# Altium project g1.PrjPcb
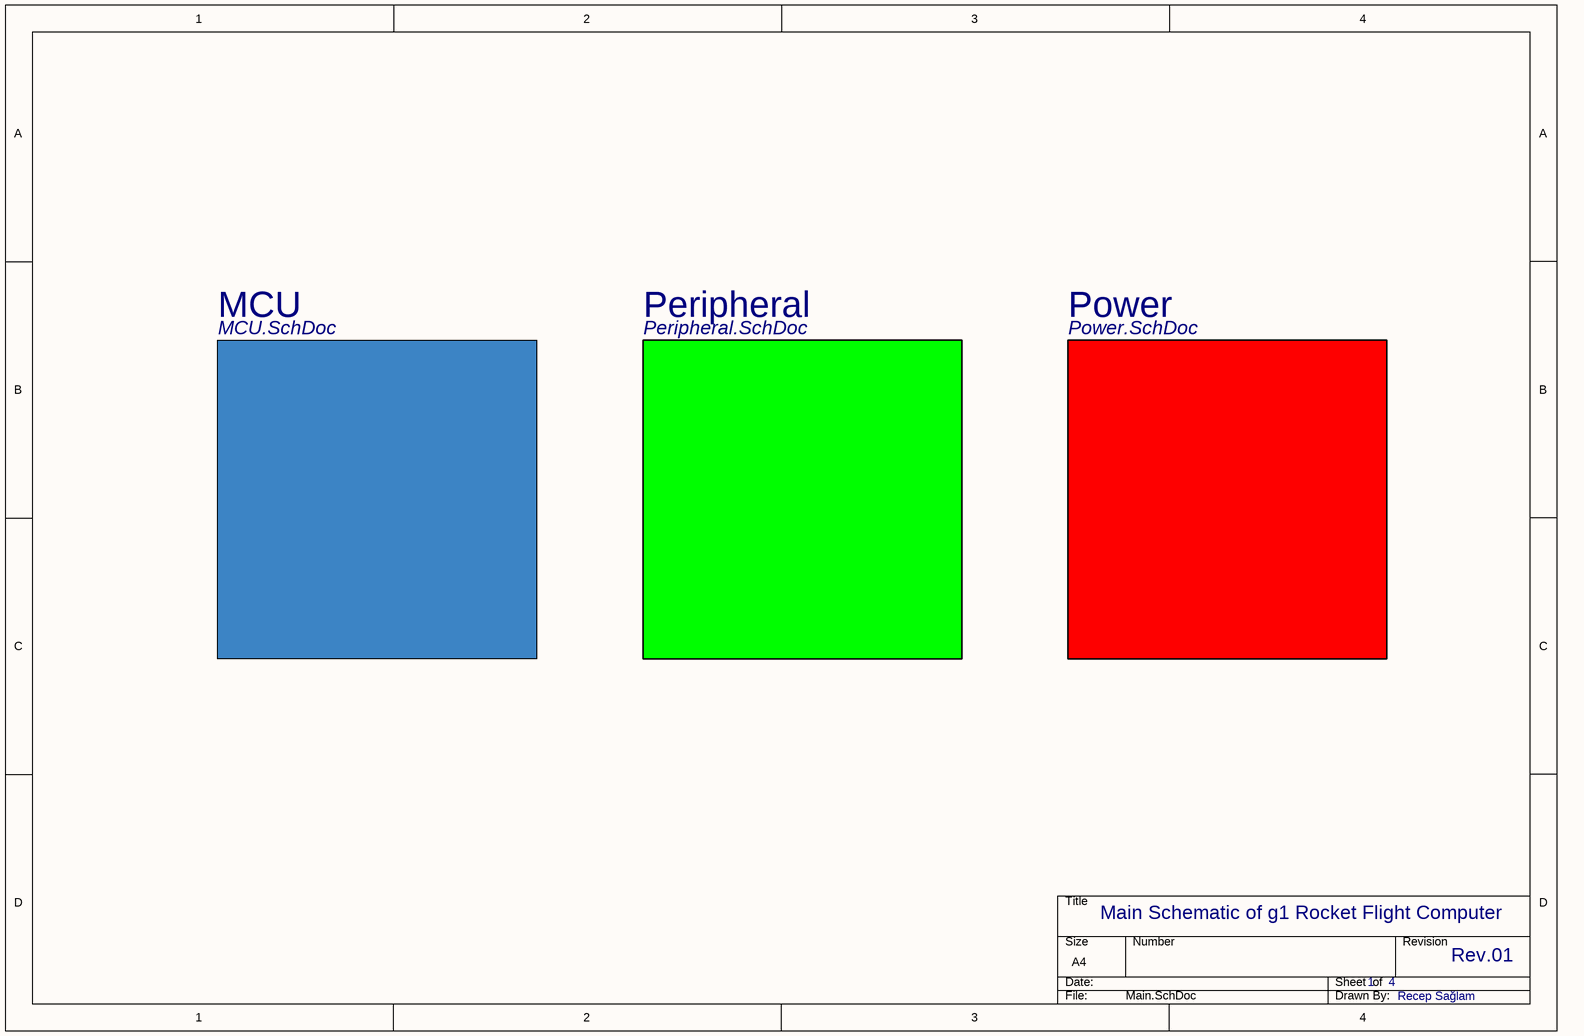
[diagram p0: Main.SchDoc]
4 sheets, 65 parts. Net scope: flat (ports and power ports of the same name join across sheets).
Board file: g1.PcbDoc
Sheets:
  Main.SchDoc
    MCU = MCU.SchDoc
    Power = Power.SchDoc
    Peripheral = Peripheral.SchDoc

## Sheet Main.SchDoc
size A4; SheetNumber: 1; SheetTotal: 4

### Sub-sheets
MCU = MCU.SchDoc: no entries
Peripheral = Peripheral.SchDoc: no entries
Power = Power.SchDoc: no entries

### Notes on the sheet
- Main Schematic of g1 Rocket Flight Computer
- 1
- 4
- Rev.01
- Recep Sağlam

## Sheet MCU.SchDoc
size 384 x 270 mm; SheetNumber: 2; SheetTotal: 4
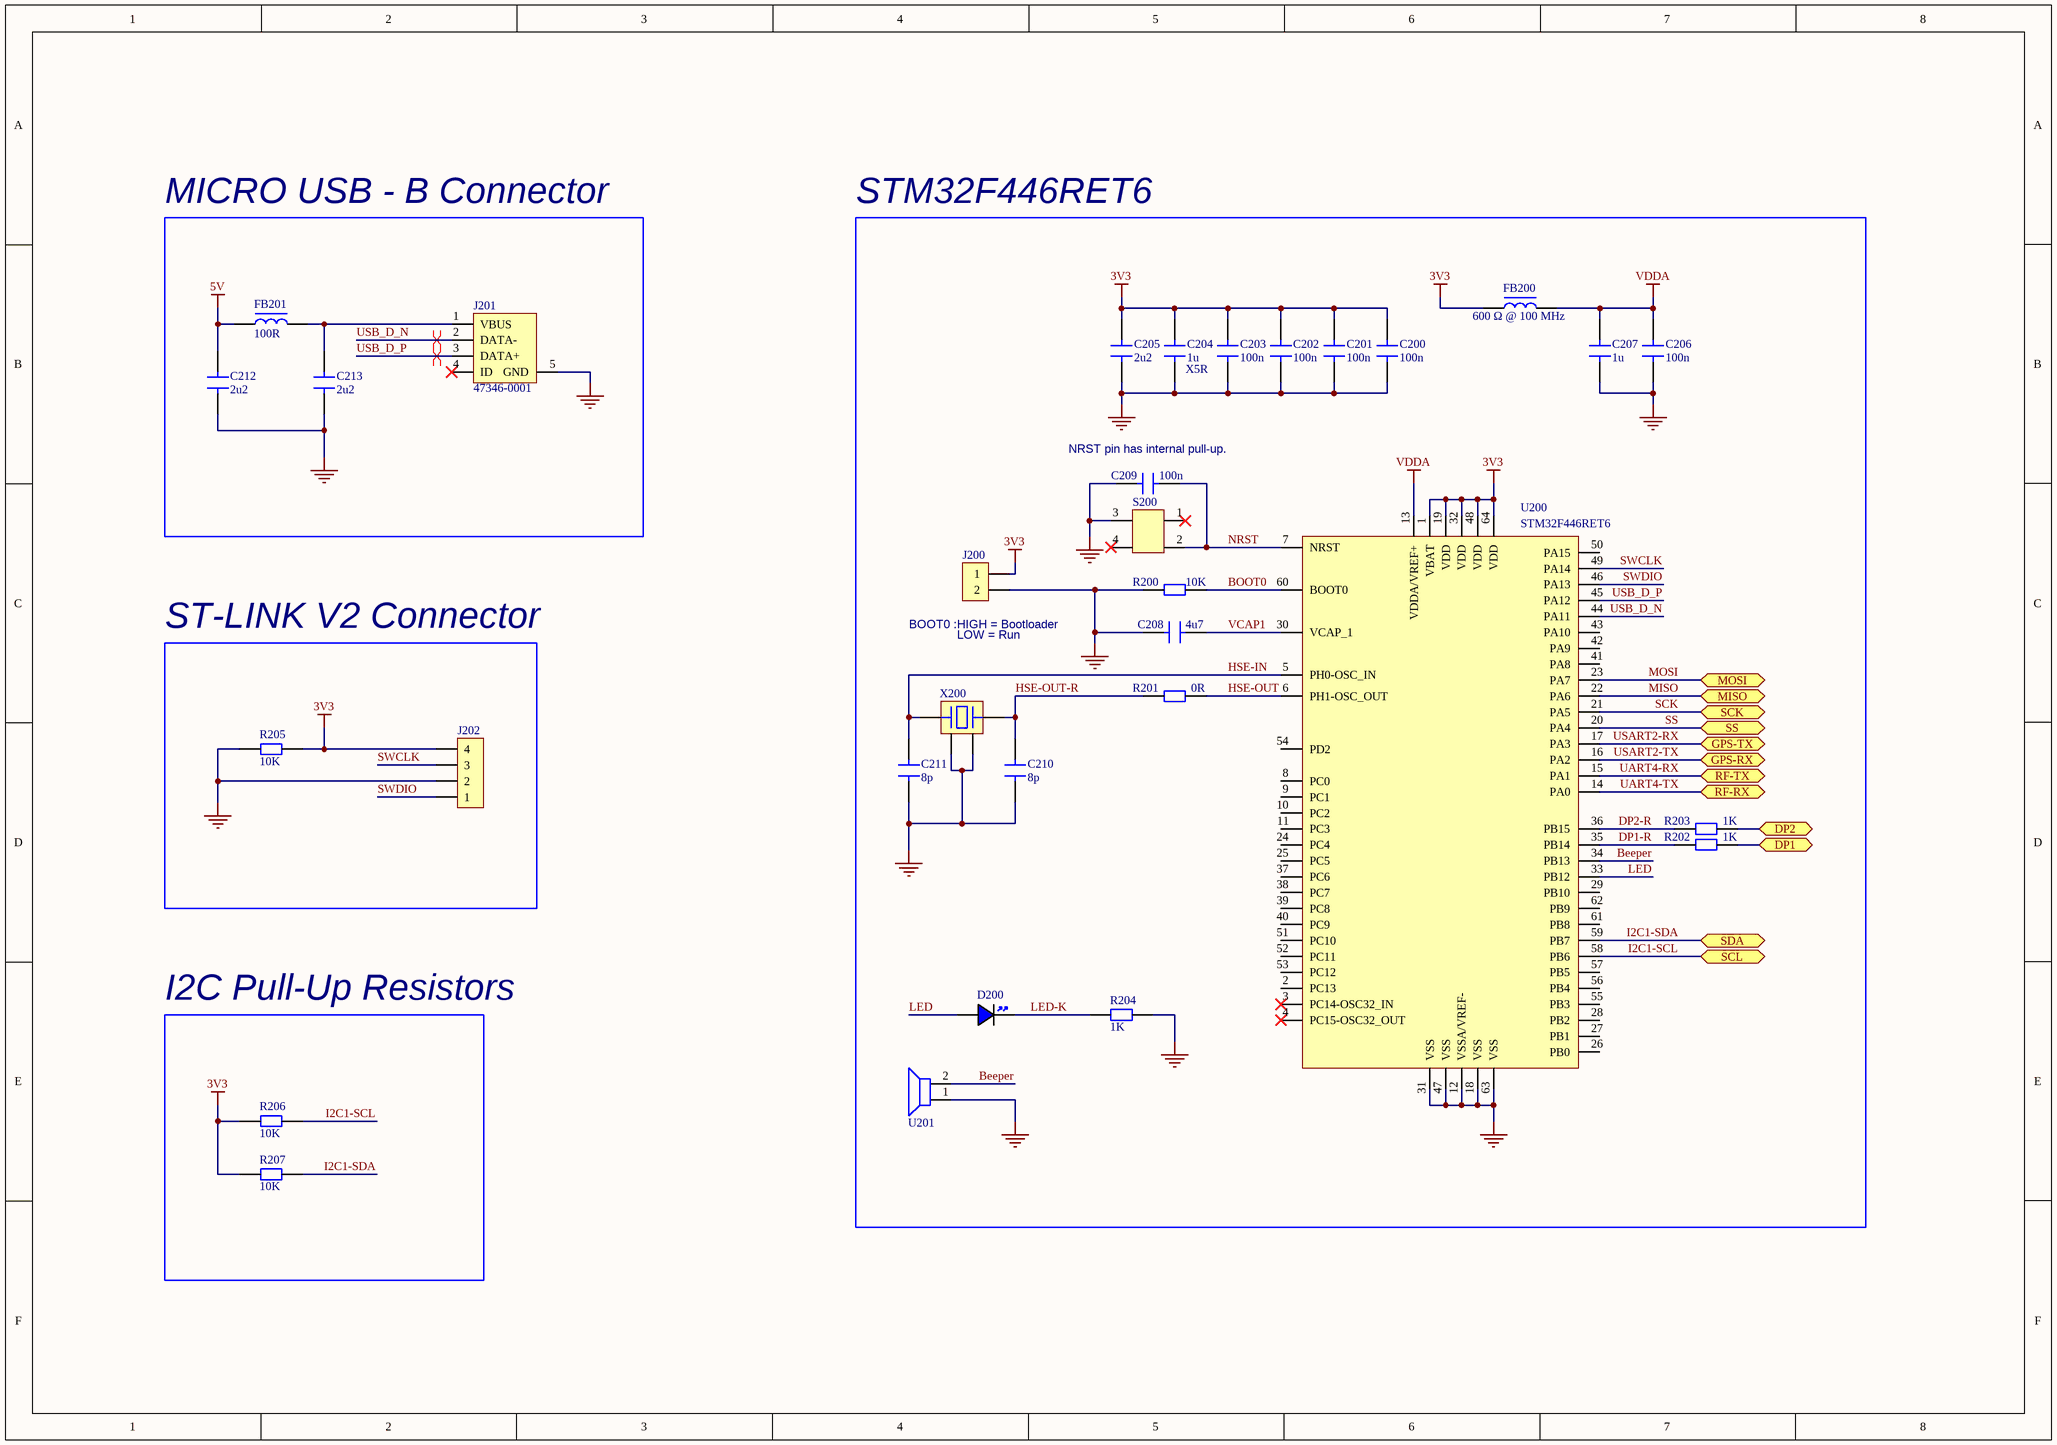
[diagram p1: MCU.SchDoc]

### Parts
C200  100n  [CAP 0603]
C201  100n  [CAP 0603]
C202  100n  [CAP 0603]
C203  100n  [CAP 0603]
C204  1u  [CAP 0603]
C205  2u2  [CAP 0603]
C206  100n  [CAP 0603]
C207  1u  [CAP 0603]
C208  4u7  [CAP 0805]
C209  100n  [CAP 0603]
C210  8p  [CAP 0603]
C211  8p  [CAP 0603]
C212  2u2  [CAP 0603]
C213  2u2  [CAP 0603]
D200  LED 0805 BLUE  [LED 0805 BLUE]  (value not drawn)
FB200  600 Ω @ 100 MHz  [FB 0603]
FB201  100R  [FB 0805]
J200  1x2 HEADER  [1x2 HEADER MALE]  (value not drawn)
J201  47346-0001  [MOLEX_47346-0001]
J202  1x4 HEADER MALE  [1X4 HEADER MALE]  (value not drawn)
R200  10K  [RES 0603]
R201  0R  [RES 0603]
R202  1K  [RES 0603]
R203  1K  [RES 0603]
R204  1K  [RES 0603]
R205  10K  [RES 0603]
R206  10K  [RES 0603]
R207  10K  [RES 0603]
S200  FSM4JSMATR  [FSM4JSMATR]  (value not drawn)
U200  STM32F446RET6  [STM32F446RET6]
U201  PS1240P02BT  [PS1240P02BT]  (value not drawn)
X200  FA-20H 16.0000MF10Z-AJ0  [FA-20H 16.0000MF10Z-AJ0]  (value not drawn)

### Blocks framed on the sheet
MICRO USB - B Connector: C212 C213 FB201 J201
STM32F446RET6: C200-C211 D200 FB200 J200 R200-R204 S200 U200 U201 X200
ST-LINK V2 Connector: J202 R205
I2C Pull-Up Resistors: R206 R207

### Ports
DP1 (bidir, see Power[1C]), DP2 (bidir, see Power[3C]), GPS-RX (bidir, see Peripheral[4C]), GPS-TX (bidir, see Peripheral[4C]), MISO (bidir, see Peripheral[1B], Peripheral[3C]), MOSI (bidir, see Peripheral[1B], Peripheral[3C]), RF-RX (bidir, see Peripheral[3C]), RF-TX (bidir, see Peripheral[3C]), SCK (bidir, see Peripheral[1B], Peripheral[3D]), SCL (bidir, see Peripheral[2C], Peripheral[3A], Peripheral[3C]), SDA (bidir, see Peripheral[2C], Peripheral[3A], Peripheral[3C]), SS (bidir, see Peripheral[1B], Peripheral[3C])

### Nets
3V3: C200.2 C201.2 C202.2 C203.2 C204.2 C205.2 FB200.1 J200.1 J202.4 R205.2 R206.2 R207.2 U200.1(VBAT) U200.19(VDD) U200.32(VDD) U200.48(VDD) U200.64(VDD)
5V: C212.1 FB201.1
GND: C200.1 C201.1 C202.1 C203.1 C204.1 C205.1 C206.1 C207.1 C208.1 C209.1 C210.1 C211.1 C212.2 C213.2 J200.2 J201.5(GND) J202.2 R200.1 R204.2 R205.1 S200.3 U200.12(VSSA/VREF-) U200.18(VSS) U200.31(VSS) U200.47(VSS) U200.63(VSS) U201.1 X200.2 X200.4
VDDA: C206.2 C207.2 FB200.2 U200.13(VDDA/VREF+)
Beeper: U200.34(PB13) U201.2
BOOT0: R200.2 U200.60(BOOT0)
DP1-R: R202.2 U200.35(PB14)
DP2-R: R203.1 U200.36(PB15)
HSE-IN: C211.2 U200.5(PH0-OSC_IN) X200.1
HSE-OUT: R201.2 U200.6(PH1-OSC_OUT)
HSE-OUT-R: C210.2 R201.1 X200.3
I2C1-SCL: R206.1 U200.58(PB6) ; port SCL
I2C1-SDA: R207.1 U200.59(PB7) ; port SDA
LED: D200.A U200.33(PB12)
LED-K: D200.K R204.1
MISO: U200.22(PA6) ; port MISO
MOSI: U200.23(PA7) ; port MOSI
NRST: C209.2 S200.2 U200.7(NRST)
SCK: U200.21(PA5) ; port SCK
SS: U200.20(PA4) ; port SS
SWCLK: J202.3 U200.49(PA14)
SWDIO: J202.1 U200.46(PA13)
UART4-RX: U200.15(PA1) ; port RF-TX
UART4-TX: U200.14(PA0) ; port RF-RX
USART2-RX: U200.17(PA3) ; port GPS-TX
USART2-TX: U200.16(PA2) ; port GPS-RX
USB_D_N: J201.2(DATA-) U200.44(PA11)
USB_D_P: J201.3(DATA+) U200.45(PA12)
VCAP1: C208.2 U200.30(VCAP_1)
NetC213_1: C213.1 FB201.2 J201.1(VBUS)
NetR202_1: R202.1 ; port DP1
NetR203_2: R203.2 ; port DP2

Not connected (* = marked no-connect by the designer): J201 4(ID)*; S200 1* 4*; U200 2(PC13) 3(PC14-OSC32_IN)* 4(PC15-OSC32_OUT)* 8(PC0) 9(PC1) 10(PC2) 11(PC3) 24(PC4) 25(PC5) 26(PB0) 27(PB1) 28(PB2) 29(PB10) 37(PC6) 38(PC7) 39(PC8) 40(PC9) 41(PA8) 42(PA9) 43(PA10) 50(PA15) 51(PC10) 52(PC11) 53(PC12) 54(PD2) 55(PB3) 56(PB4) 57(PB5) 61(PB8) 62(PB9)

### Layout directives
differential pair; differential pair class DIFF_USB: USB_D_N, USB_D_P

### Notes on the sheet
- (near C204) X5R
- (near C209) NRST pin has internal pull-up.
- (near J200) BOOT0 :
- (near J200) HIGH = Bootloader
- (near J200) LOW = Run
- DWG NO:
- REV:
- THIS DOCUMENT AND THE DATA DISCLOSED HEREIN OR
- HEREWITH IS THE PROPERTY OF ALTIUM LIMITED AND MAY
- BE FREELY DISTRIBUTED IN WHOLE. NO RIGHTS ARE
- RESERVED OR EXPRESS OR IMPLIED WARANTEE GIVEN.
- REVISION
- DESCRIPTION
- DATE
- APPROVED
- ENG:
- APPROVALS
- PROJECT
- DSN:
- CHK:
- REFERENCE DOCUMENTS
- PROJECT REVISION:
- TITLE
- DOCUMENT REVISION:
- DESIGN ITEM:
- BOM:
- FAB DWG:
- PCB DWG:
- ASSY DWG:
- SCALE:
- A2
- SIZE
- CAGE CODE
- FILE NAME
- DWG NO.
- SHEET
- OF
- REV

### Library data of the parts
C200-C203 C205-C207 C209-C213 = CAP 0603 50V: Capacitor SMD 0603 50V
C204 = CAP 0603 16V: Capacitor SMD 0603 16V
C208 = CAP 0805 25V: Capacitor SMD 0805 25V
D200 = LED 0805 BLUE: LED 0805 GREEN SMD
FB200 = FB 0603: Ferrite Bead SMD 0603
FB201 = FB 0805: Ferrite Bead SMD 0805
J201 = 47346-0001: Micro-USB B Receptacle with Flange, Bottom Mount, Surface Mount, Lead-Free; Manufacturer: Molex; Max Voltage Rating (AC): 30V; Number of Ports: 1; Contact Resistance: 40mR; Current Rating: 1.8A; Gender: Female; Connector Type: USB,Receptacle; Number of Contacts: 5; Contact Current Rating: 1A; USB Standard: USB 2.0; Pitch: 0.65mm; Glow Wire Compliant: Non-compliant; Supplier 1: Sager Electronics; Manufacturer Part Number: 47346-0001; RoHS: Yes; Category: Headers and Wire Housings; Stock 1: 14156; Pricing 1: 14000=0,5225 (USD); Mount: Surface Mount; Contact Plating: Gold; Contact Material: Copper Alloy,Copper; Housing Material: Polymer; Color: Black; Min Operating Temperature: -20°C; Max Operating Temperature: 85°C; Packaging: Tape and Reel; Termination: SMD/SMT; Orientation: Right Angle; Voltage Rating (AC): 30V; Voltage Rating: 30V; Number of Circuits: 5; Number of Positions: 5; Number of Rows: 1; Series: 47346; RoHS Compliant: Yes; Halogen Free: Low Halogen; Lead Free: Lead Free; Flammability Rating: UL94 V-0; Reach SVHC Compliant: Unknown; ComponentLink1URL: https://datasheet.ciiva.com/30075/304740473460001-io-nectors-30075527.pdf?src-supplier=Onlinecomponents.com; ComponentLink1Description: https://datasheet.ciiva.com/30075/304740473460001-io-nectors-30075527.pdf?src-supplier=Onlinecomponents.com; ComponentLink2URL: https://datasheet.ciiva.com/22654/1630785-22654942.pdf?src-supplier=Element14; ComponentLink2Description: https://datasheet.ciiva.com/22654/1630785-22654942.pdf?src-supplier=Element14; ComponentLink3URL: https://datasheet.ciiva.com/16148/1700180473460001-io-nectors-16148917.pdf?src-supplier=Onlinecomponents.com; ComponentLink3Description: https://datasheet.ciiva.com/16148/1700180473460001-io-nectors-16148917.pdf?src-supplier=Onlinecomponents.com; ComponentLink4URL: https://datasheet.ciiva.com/16986/70266948-16986683.pdf?src-supplier=Allied+Electronics; ComponentLink4Description: https://datasheet.ciiva.com/16986/70266948-16986683.pdf?src-supplier=Allied+Electronics; ComponentLink5URL: https://datasheet.ciiva.com/28504/0473460001-io-connectors-28504587.pdf?src-supplier=Element14; ComponentLink5Description: https://datasheet.ciiva.com/28504/0473460001-io-connectors-28504587.pdf?src-supplier=Element14; ComponentLink6URL: https://datasheet.ciiva.com/46390/1681853-46390956.pdf?src-supplier=Element14; ComponentLink6Description: https://datasheet.ciiva.com/46390/1681853-46390956.pdf?src-supplier=Element14
R200-R207 = RES 0603: Resistor SMD 0603
S200 = FSM4JSMATR: Switch Tactile OFF (ON) SPST Round Button Gull Wing 0.05A 24VDC 1.57N SMD T/R; Manufacturer: TE Connectivity Alcoswitch; Supplier 1: Digi-Key; Manufacturer Part Number: FSM4JSMATR; RoHS: Yes; Category: Pushbutton Switches; Stock 1: 84996; Pricing 1: 1=0,36, 10=0,351, 25=0,33, 100=0,2866, 250=0,26, 500=0,24188 (USD); ComponentLink1URL: https://datasheet.ciiva.com/16320/eng-cs-1308111-1-switches-core-program-catalog-0308-16320065.pdf?src-supplier=Future+Electronics; ComponentLink1Description: https://datasheet.ciiva.com/16320/eng-cs-1308111-1-switches-core-program-catalog-0308-16320065.pdf?src-supplier=Future+Electronics; ComponentLink2URL: https://datasheet.ciiva.com/1530/1683375-1530944.pdf?src-supplier=Element14; ComponentLink2Description: https://datasheet.ciiva.com/1530/1683375-1530944.pdf?src-supplier=Element14; ComponentLink3URL: https://datasheet.ciiva.com/23765/1486934-23765878.pdf?src-supplier=Newark; ComponentLink3Description: https://datasheet.ciiva.com/23765/1486934-23765878.pdf?src-supplier=Newark; ComponentLink4URL: https://datasheet.ciiva.com/7638/921681-7638037.pdf?src-supplier=Element14; ComponentLink4Description: https://datasheet.ciiva.com/7638/921681-7638037.pdf?src-supplier=Element14
U200 = STM32F446RET6: ARM® Cortex®-M4 STM32 F4 Microcontroller IC 32-Bit 180MHz 512KB (512K x 8) FLASH 64-LQFP (10x10); Manufacturer: STMicroelectronics; Supplier 1: Mouser; Manufacturer Part Number: STM32F446RET6; RoHS: Yes; Category: Microcontrollers; Stock 1: 2954; Pricing 1: 1=12,45, 10=11,25, 50=10,54, 100=9,5, 1000=6,72, 10000=6,72 (USD); ComponentLink1URL: http://www.mouser.com/ds/2/389/stm32f446mc-956216.pdf?src-supplier=Mouser; ComponentLink1Description: http://www.mouser.com/ds/2/389/stm32f446mc-956216.pdf?src-supplier=Mouser; ComponentLink2URL: http://www.farnell.com/datasheets/2309063.pdf?src-supplier=Farnell; ComponentLink2Description: http://www.farnell.com/datasheets/2309063.pdf?src-supplier=Farnell; ComponentLink3URL: https://datasheet.octopart.com/STM32F446RET6-STMicroelectronics-datasheet-58295083.pdf?src-supplier=Future+Electronics; ComponentLink3Description: https://datasheet.octopart.com/STM32F446RET6-STMicroelectronics-datasheet-58295083.pdf?src-supplier=Future+Electronics; ComponentLink4URL: http://www.st.com/content/ccc/resource/technical/document/datasheet/65/cb/75/50/53/d6/48/24/DM00141306.pdf/files/DM00141306.pdf/jcr:content/translations/en.DM00141306.pdf?src-supplier=Digi-Key; ComponentLink4Description: http://www.st.com/content/ccc/resource/technical/document/datasheet/65/cb/75/50/53/d6/48/24/DM00141306.pdf/files/DM00141306.pdf/jcr:content/translations/en.DM00141306.pdf?src-supplier=Digi-Key; ComponentLink5URL: http://www.farnell.com/datasheets/2309063.pdf?src-supplier=Element14; ComponentLink5Description: http://www.farnell.com/datasheets/2309063.pdf?src-supplier=Element14; ComponentLink6URL: https://datasheet.octopart.com/STM32F446RET6-STMicroelectronics-datasheet-41797127.pdf?src-supplier=Element14; ComponentLink6Description: https://datasheet.octopart.com/STM32F446RET6-STMicroelectronics-datasheet-41797127.pdf?src-supplier=Element14; ComponentLink7URL: http://www.farnell.com/datasheets/2309063.pdf?src-supplier=Newark; ComponentLink7Description: http://www.farnell.com/datasheets/2309063.pdf?src-supplier=Newark; ComponentLink8URL: https://datasheet.octopart.com/STM32F446RET6-STMicroelectronics-datasheet-83961502.pdf?src-supplier=SHENGYU+ELECTRONICS; ComponentLink8Description: https://datasheet.octopart.com/STM32F446RET6-STMicroelectronics-datasheet-83961502.pdf?src-supplier=SHENGYU+ELECTRONICS
U201 = PS1240P02BT: Audio Buzzer Piezo 30Vo-p 3Vo-p 70dBA Through Hole Pin Ammo; Manufacturer: TDK; Supplier 1: CoreStaff; Manufacturer Part Number: PS1240P02BT; RoHS: Yes; Category: Audio Products; Stock 1: 34; Pricing 1: 1=156, 10=90, 50=60, 100=45, 500=39, 1000=34,5, 2000=30, 4000=29,1 (JPY); ComponentLink1URL: https://datasheet.ciiva.com/0/ef532-ps-112.pdf?src-supplier=Digi-Key; ComponentLink1Description: https://datasheet.ciiva.com/0/ef532-ps-112.pdf?src-supplier=Digi-Key; ComponentLink2URL: https://datasheet.ciiva.com/0/ef532-ps-111.pdf?src-supplier=Digi-Key; ComponentLink2Description: https://datasheet.ciiva.com/0/ef532-ps-111.pdf?src-supplier=Digi-Key; ComponentLink3URL: https://datasheet.ciiva.com/3306/ef532-ps-3306958.pdf?src-supplier=Avnet; ComponentLink3Description: https://datasheet.ciiva.com/3306/ef532-ps-3306958.pdf?src-supplier=Avnet; ComponentLink4URL: https://datasheet.ciiva.com/16225/ef532-ps-16225062.pdf?src-supplier=Onlinecomponents.com; ComponentLink4Description: https://datasheet.ciiva.com/16225/ef532-ps-16225062.pdf?src-supplier=Onlinecomponents.com
X200 = FA-20H 16.0000MF10Z-AJ0: Crystal 16MHz ±10ppm (Tol) ±10ppm (Stability) 8pF FUND 80Ohm 4-Pin Ultra Mini-CSMD T/R; Manufacturer: Epson; Supplier 1: Digi-Key; Manufacturer Part Number: FA-20H 16.0000MF10Z-AJ0; RoHS: Yes; Category: Crystals; Stock 1: 229665; Pricing 1: 1=0,73, 10=0,606, 50=0,5454, 100=0,4848, 500=0,46056 (USD); ComponentLink1URL: https://support.epson.biz/td/api/doc_check.php?dl=brief_FA-20H&amp;lang=en&src-supplier=Digi-Key; ComponentLink1Description: https://support.epson.biz/td/api/doc_check.php?dl=brief_FA-20H&amp;lang=en&src-supplier=Digi-Key; ComponentLink2URL: https://www5.epsondevice.com/en/information/support/pdf/june_2018_psc_masterbook.pdf?src-supplier=Digi-Key; ComponentLink2Description: https://www5.epsondevice.com/en/information/support/pdf/june_2018_psc_masterbook.pdf?src-supplier=Digi-Key; ComponentLink3URL: https://www.eea.epson.com/wp-content/uploads/2016/11/November-2016-PCS-MASTER-BOOK.pdf?src-supplier=Digi-Key; ComponentLink3Description: https://www.eea.epson.com/wp-content/uploads/2016/11/November-2016-PCS-MASTER-BOOK.pdf?src-supplier=Digi-Key

## Sheet Power.SchDoc
size A4; SheetNumber: 4; SheetTotal: 4
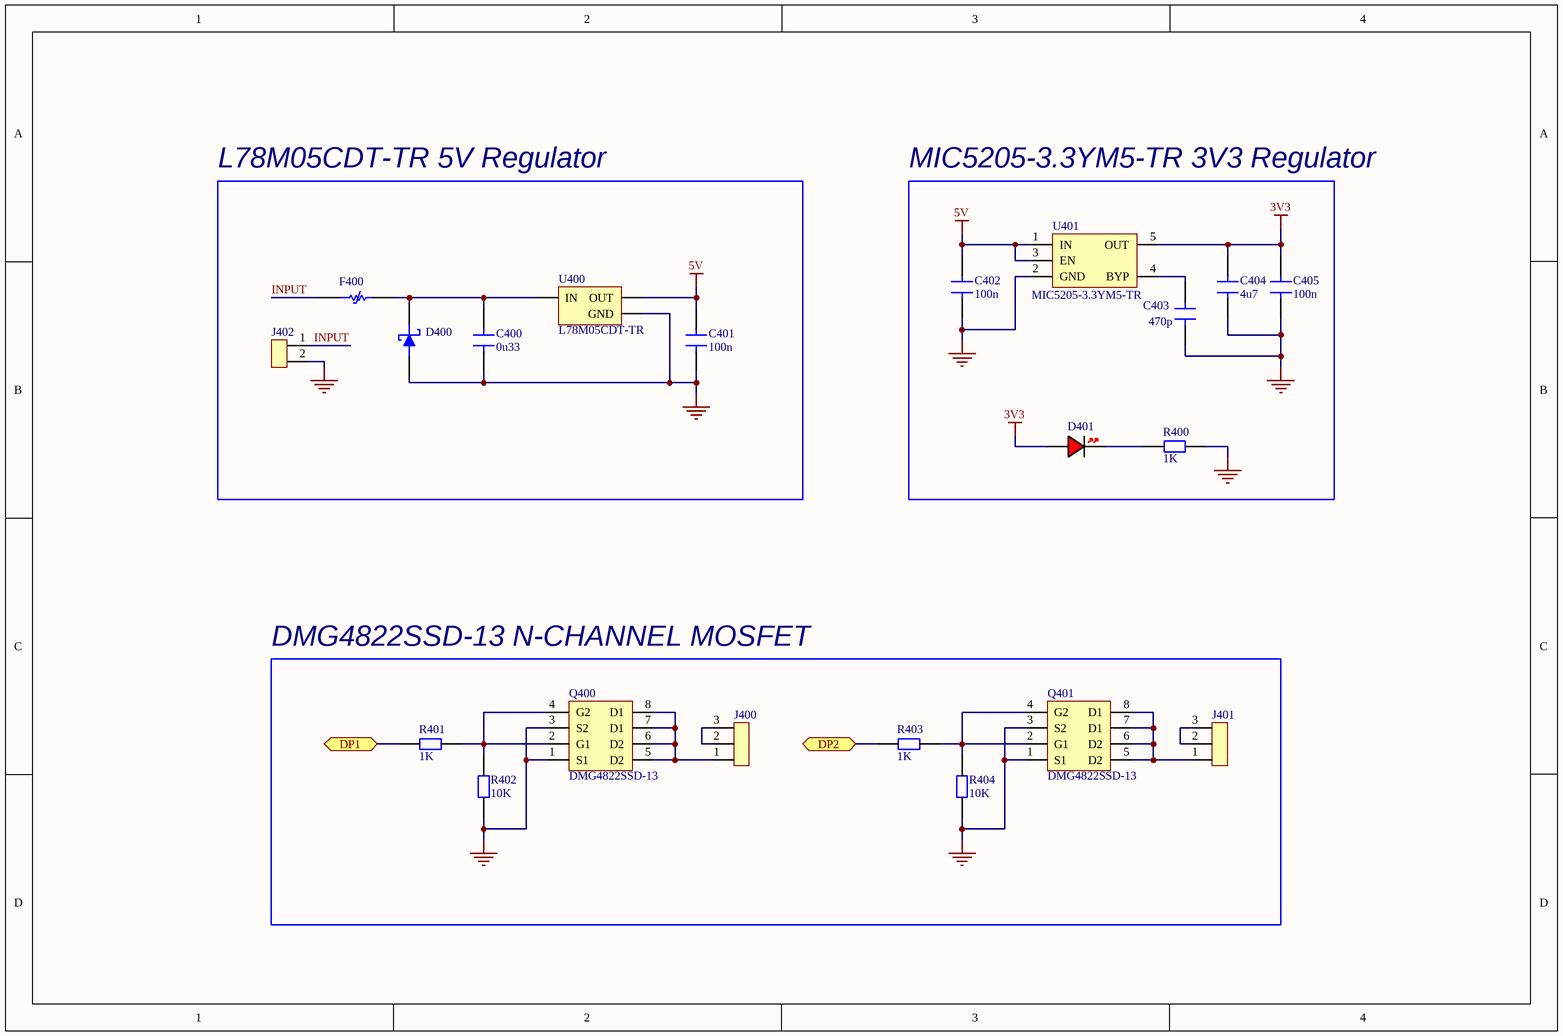
[diagram p2: Power.SchDoc]

### Parts
C400  0u33  [CAP 0805]
C401  100n  [CAP 0805]
C402  100n  [CAP 0805]
C403  470p  [CAP 0805]
C404  4u7  [CAP 0805]
C405  100n  [CAP 0805]
D400  SMBJ12CA-13-F  [SMBJ12CA-13-F]  (value not drawn)
D401  LED 0805 RED  [LED 0805 RED]  (value not drawn)
F400  0ZCG0075FF2C  [0ZCG0075FF2C]  (value not drawn)
J400  KF301 3P Terminal  [KF301 3P]  (value not drawn)
J401  KF301 3P Terminal  [KF301 3P]  (value not drawn)
J402  KF301 2P Terminal  [KF301 2P]  (value not drawn)
Q400  DMG4822SSD-13  [DMG4822SSD-13]
Q401  DMG4822SSD-13  [DMG4822SSD-13]
R400  1K  [RES 0603]
R401  1K  [RES 0603]
R402  10K  [RES 0603]
R403  1K  [RES 0603]
R404  10K  [RES 0603]
U400  L78M05CDT-TR  [L78M05CDT-TR]
U401  MIC5205-3.3YM5-TR  [MIC5205-3.3YM5-TR]

### Blocks framed on the sheet
L78M05CDT-TR 5V Regulator: C400 C401 D400 F400 J402 U400
MIC5205-3.3YM5-TR 3V3 Regulator: C402-C405 D401 R400 U401
DMG4822SSD-13 N-CHANNEL MOSFET: J400 J401 Q400 Q401 R401-R404

### Ports
DP1 (bidir, see MCU[5D]), DP2 (bidir, see MCU[7D])

### Nets
3V3: C404.2 C405.2 D401.A U401.5(OUT)
5V: C401.2 C402.2 U400.3(OUT) U401.1(IN) U401.3(EN)
GND: C400.1 C401.1 C402.1 C403.1 C404.1 C405.1 D400.1 J402.2 Q400.1(S1) Q400.3(S2) Q401.1(S1) Q401.3(S2) R400.2 R402.1 R404.1 U400.2(GND) U401.2(GND)
INPUT: F400.1 J402.1
NetC400_2: C400.2 D400.2 F400.2 U400.1(IN)
NetC403_2: C403.2 U401.4(BYP)
NetD401_K: D401.K R400.1
NetJ400_1: J400.1 Q400.5(D2) Q400.6(D2) Q400.7(D1) Q400.8(D1)
NetJ400_2: J400.2 J400.3
NetJ401_1: J401.1 Q401.5(D2) Q401.6(D2) Q401.7(D1) Q401.8(D1)
NetJ401_2: J401.2 J401.3
NetQ400_2: Q400.2(G1) Q400.4(G2) R401.2 R402.2
NetQ401_2: Q401.2(G1) Q401.4(G2) R403.2 R404.2
NetR202_1: R401.1 ; port DP1
NetR203_2: R403.1 ; port DP2

### Library data of the parts
C400-C405 = CAP 0805 50V: Capacitor SMD 0805 50V
D400 = SMBJ12CA-13-F: TVS DIODE 12VWM 19.9VC SMB; Manufacturer: Diodes; Package Body Material: Plastic; Diode Element Material: SILICON; Voltage Rating (DC): 12V; Direction: Bidirectional; Reverse Breakdown Voltage: 13.3V; Number of Elements: 1; Max Power Dissipation: 600W; Max Surge Current: 30.2A; Breakdown Voltage: 15.3V; Clamping Voltage: 19.9V; Max Reverse Leakage Current: 5uA; Test Current: 1mA; Capacitance: 340pF; Diode Type: ZENER; Time @ Peak Reflow Temperature-Max (s): 5s; Power Line Protection: No; Supplier 1: Future Electronics; Manufacturer Part Number: SMBJ12CA-13-F; RoHS: Yes; Category: TVS Diodes; Stock 1: 27000; Pricing 1: 3000=0,104, 9000=0,0995, 12000=0,0985, 30000=0,0953, 45000=0,0922 (USD); Mount: Surface Mount; Case/Package: SMB; Number of Pins: 2; Terminal Finish: Tin; Package Shape: Rectangular; Min Operating Temperature: -55°C; Max Operating Temperature: 150°C; Package Quantity: 3000; Packaging: Tape and Reel; Series: SMBJ; Reverse Standoff Voltage: 12V; Polarity: Bidirectional; Peak Pulse Power: 600W; Termination: SMD/SMT; Min Breakdown Voltage: 13.3V; Peak Pulse Current: 30.2A; Max Breakdown Voltage: 15.3V; Power Dissipation: 600W; Leakage Current: 5uA; Working Voltage: 12V; Max Output Current: 30.2A; Moisture Sensitivity Level: 1; JESD-30 Code: R-PDSO-C2; Surface Mount: Yes; Terminal Position: DUAL; Technology: AVALANCHE; Peak Reflow Temperature (Cel): 245°C; Terminal Form: C BEND; Clamping Voltage-Max: 19.9V; Number of Bidirectional Channels: 1; Length: 4.57mm; Width: 3.9mm; Height: 2.62mm; Radiation Hardening: No; Lead Free: Contains Lead; RoHS Compliant: Yes; ComponentLink1URL: https://datasheet.ciiva.com/34302/1542303-34302437.pdf?src-supplier=Jameco; ComponentLink1Description: https://datasheet.ciiva.com/34302/1542303-34302437.pdf?src-supplier=Jameco
D401 = LED 0805 RED: LED 0805 RED SMD
F400 = 0ZCG0075FF2C: PTC Resettable Fuse 0.75A(hold) 1.5A(trip) 16VDC 100A 0.8W 0.2s 0.11Ohm SMD Solder Pad 1812 4.73 X 3.41 X 0.65mm T/R...; Manufacturer: Bel; Hold Current: 750mA; Time to Trip: 200ms; Supplier 1: Arrow Electronics; Manufacturer Part Number: 0ZCG0075FF2C; RoHS: Yes; Category: PTC Resettable Fuses; Stock 1: 4661; Pricing 1: 2000=0,0751, 4000=0,0699, 6000=0,065, 10000=0,0604 (USD); Mount: Surface Mount; Case/Package: 1812; Case Code (Metric): 4532; Case Code (Imperial): 1812; Contact Plating: Tin,Matte; Min Operating Temperature: -40°C; Max Operating Temperature: 85°C; Packaging: Cut Tape; Max Current Rating: 100A; Trip Current: 1.5A; Series: 0ZCG; Lead Free: Lead Free; RoHS Compliant: Yes; ComponentLink1URL: https://datasheet.ciiva.com/18550/0zcg-18550523.pdf?src-supplier=Digi-Key; ComponentLink1Description: https://datasheet.ciiva.com/18550/0zcg-18550523.pdf?src-supplier=Digi-Key; ComponentLink2URL: https://datasheet.ciiva.com/18550/0zcg-18550524.pdf?src-supplier=Digi-Key; ComponentLink2Description: https://datasheet.ciiva.com/18550/0zcg-18550524.pdf?src-supplier=Digi-Key; ComponentLink3URL: https://datasheet.ciiva.com/18550/0zcg-18550767.pdf?src-supplier=Digi-Key; ComponentLink3Description: https://datasheet.ciiva.com/18550/0zcg-18550767.pdf?src-supplier=Digi-Key
J400 J401 = KF301 3P Terminal: 3 Pin Screw Terminal Block 5mm
J402 = KF301 2P Terminal: 2 Pin Screw Terminal Block 5mm
Q400 Q401 = DMG4822SSD-13: Dual N-Channel 30 V 1.42 W 10.5 nC Enhancement Mode Mosfet - SOIC-8; Manufacturer: Diodes; Rds On Max: 20mR; Input Capacitance: 478.9pF; Rise Time: 7.9ns; Drain to Source Voltage (Vdss): 30V; Continuous Drain Current (ID): 10A; Max Power Dissipation: 1.42W; Fall Time: 3.1ns; Turn-Off Delay Time: 14.6ns; Turn-On Delay Time: 2.9ns; Gate to Source Voltage (Vgs): 25V; Number of Channels: 2; FET Type: 2 N-Channel; Supplier 1: Arrow Electronics; Manufacturer Part Number: DMG4822SSD-13; RoHS: Yes; Category: MOSFETs; Stock 1: 2374; Pricing 1: 1=0,5556, 10=0,4998, 25=0,4948, 100=0,3987, 250=0,3947, 500=0,3232, 1000=0,265 (USD); Mount: Surface Mount; Case/Package: SOIC; Number of Pins: 8; Weight: 0.00261oz; Min Operating Temperature: -55°C; Max Operating Temperature: 150°C; Package Quantity: 2500; Packaging: Tape and Reel; Drain to Source Resistance: 20mR; Polarity: N-CHANNEL; Series: -; Length: 4.95mm; Width: 3.95mm; Height: 1.5mm; Radiation Hardening: No; Lead Free: Lead Free; Reach SVHC Compliant: Yes; RoHS Compliant: Yes; ComponentLink1URL: https://datasheet.ciiva.com/4443/dmg4822ssd-10758-4443079.pdf?src-supplier=Mouser; ComponentLink1Description: https://datasheet.ciiva.com/4443/dmg4822ssd-10758-4443079.pdf?src-supplier=Mouser; ComponentLink2URL: https://datasheet.ciiva.com/6386/dmg4822ssd-6386688.pdf?src-supplier=Digi-Key; ComponentLink2Description: https://datasheet.ciiva.com/6386/dmg4822ssd-6386688.pdf?src-supplier=Digi-Key; ComponentLink3URL: https://datasheet.ciiva.com/11174/dmg4822ssd-11174891.pdf?src-supplier=Avnet; ComponentLink3Description: https://datasheet.ciiva.com/11174/dmg4822ssd-11174891.pdf?src-supplier=Avnet
R400-R404 = RES 0603: Resistor SMD 0603
U400 = L78M05CDT-TR: IC REG LDO 5V 0.5A DPAK; Manufacturer: STMicroelectronics; Number of Outputs: 1; Max Input Voltage: 35V; Max Output Current: 500mA; Polarity: Positive; Quiescent Current: 6mA; Output Type: Fixed; Min Input Voltage: 7V; Dropout Voltage: 2V; Tolerance: 5%; Power Supply Rejection Ratio (PSRR): 62dB; Supplier 1: Mouser; Manufacturer Part Number: L78M05CDT-TR; RoHS: Yes; Category: Voltage Regulators - Linear; Stock 1: 74380; Pricing 1: 1=0,72, 10=0,629, 50=0,629, 100=0,482, 1000=0,305, 10000=0,277 (USD); Mount: Surface Mount; Case/Package: TO-252; Number of Pins: 3; Min Operating Temperature: 0°C; Max Operating Temperature: 150°C; Output Voltage: 5V; Packaging: Tape and Reel; Package Quantity: 2500; Output Current: 500mA; Nominal Output Voltage: 5V; Number of Regulators: 1; Min Output Voltage: 5V; Max Output Voltage: 5V; Series: -; Output Configuration: Positive; Length: 6.6mm; Width: 6.2mm; Height: 2.4mm; Radiation Hardening: No; RoHS Compliant: Yes; Reach SVHC Compliant: No; Lead Free: Lead Free; ComponentLink1URL: https://datasheet.ciiva.com/34303/2021024-34303902.pdf?src-supplier=Jameco; ComponentLink1Description: https://datasheet.ciiva.com/34303/2021024-34303902.pdf?src-supplier=Jameco; ComponentLink2URL: https://datasheet.ciiva.com/4882/cd00000447-93067-4882369.pdf?src-supplier=Mouser; ComponentLink2Description: https://datasheet.ciiva.com/4882/cd00000447-93067-4882369.pdf?src-supplier=Mouser; ComponentLink3URL: https://datasheet.ciiva.com/15111/getdatasheetpartid-111001-15111751.pdf?src-supplier=Verical; ComponentLink3Description: https://datasheet.ciiva.com/15111/getdatasheetpartid-111001-15111751.pdf?src-supplier=Verical; ComponentLink4URL: https://datasheet.ciiva.com/1512/1834365-1512349.pdf?src-supplier=Element14; ComponentLink4Description: https://datasheet.ciiva.com/1512/1834365-1512349.pdf?src-supplier=Element14; ComponentLink5URL: https://datasheet.ciiva.com/14111/tbl78mxxc-data-e-14111354.pdf?src-supplier=Distrelec; ComponentLink5Description: https://datasheet.ciiva.com/14111/tbl78mxxc-data-e-14111354.pdf?src-supplier=Distrelec; ComponentLink6URL: https://datasheet.ciiva.com/46425/1834365-46425535.pdf?src-supplier=Element14; ComponentLink6Description: https://datasheet.ciiva.com/46425/1834365-46425535.pdf?src-supplier=Element14; ComponentLink7URL: https://datasheet.ciiva.com/2041/cd00000447-2041991.pdf?src-supplier=Digi-Key; ComponentLink7Description: https://datasheet.ciiva.com/2041/cd00000447-2041991.pdf?src-supplier=Digi-Key; ComponentLink8URL: https://datasheet.ciiva.com/2041/cd00000447-2041990.pdf?src-supplier=Digi-Key; ComponentLink8Description: https://datasheet.ciiva.com/2041/cd00000447-2041990.pdf?src-supplier=Digi-Key; ComponentLink9URL: https://datasheet.ciiva.com/2041/cd00000447-2041992.pdf?src-supplier=Digi-Key; ComponentLink9Description: https://datasheet.ciiva.com/2041/cd00000447-2041992.pdf?src-supplier=Digi-Key; ComponentLink10URL: https://datasheet.ciiva.com/16443/cd00000447-16443381.pdf?src-supplier=Future+Electronics; ComponentLink10Description: https://datasheet.ciiva.com/16443/cd00000447-16443381.pdf?src-supplier=Future+Electronics; ComponentLink11URL: https://datasheet.ciiva.com/41439/001184659-da-01-en-ic-reg-ldo-5v-l78m05cdt-tr-to-252-3-stm-41439772.pdf?src-supplier=Conrad; ComponentLink11Description: https://datasheet.ciiva.com/41439/001184659-da-01-en-ic-reg-ldo-5v-l78m05cdt-tr-to-252-3-stm-41439772.pdf?src-supplier=Conrad
U401 = MIC5205-3.3YM5-TR: Linear Voltage Regulator IC Positive Fixed 1 Output 3.3V 150mA SOT-23-5; Manufacturer: Microchip; Dropout Voltage: 165mV; Number of Regulators: 1; Min Input Voltage: 2.5V; Max Input Voltage: 16V; Power Supply Rejection Ratio (PSRR): 75dB; Accuracy: 1%; Supplier 1: Arrow Electronics; Manufacturer Part Number: MIC5205-3.3YM5-TR; RoHS: Yes; Category: Voltage Regulators - Linear; Stock 1: 2538; Pricing 1: 1=0,5386, 10=0,5334, 25=0,4417, 50=0,4373, 100=0,395, 250=0,3909, 500=0,3869, 1000=0,3827, 3000=0,3677 (USD); Mount: Surface Mount; Case/Package: SOT-23; Number of Pins: 5; Min Operating Temperature: -40°C; Max Operating Temperature: 125°C; Packaging: Tape and Reel; Output Voltage: 3.3V; Output Current: 150mA; Nominal Output Voltage: 3.3V; Number of Outputs: 1; Output Type: Fixed; Polarity: Positive; Series: -; Max Output Current: 150mA; Output Voltage Accuracy: 1%; Max Output Voltage: 3.3V; Max Supply Voltage: 16V; Min Supply Voltage: 2.5V; Termination: SMD/SMT; Length: 2.9mm; Width: 1.6mm; Height: 1.1mm; Radiation Hardening: No; Reach SVHC Compliant: No; Lead Free: Lead Free; RoHS Compliant: Yes

## Sheet Peripheral.SchDoc
size A4; SheetNumber: 3; SheetTotal: 4
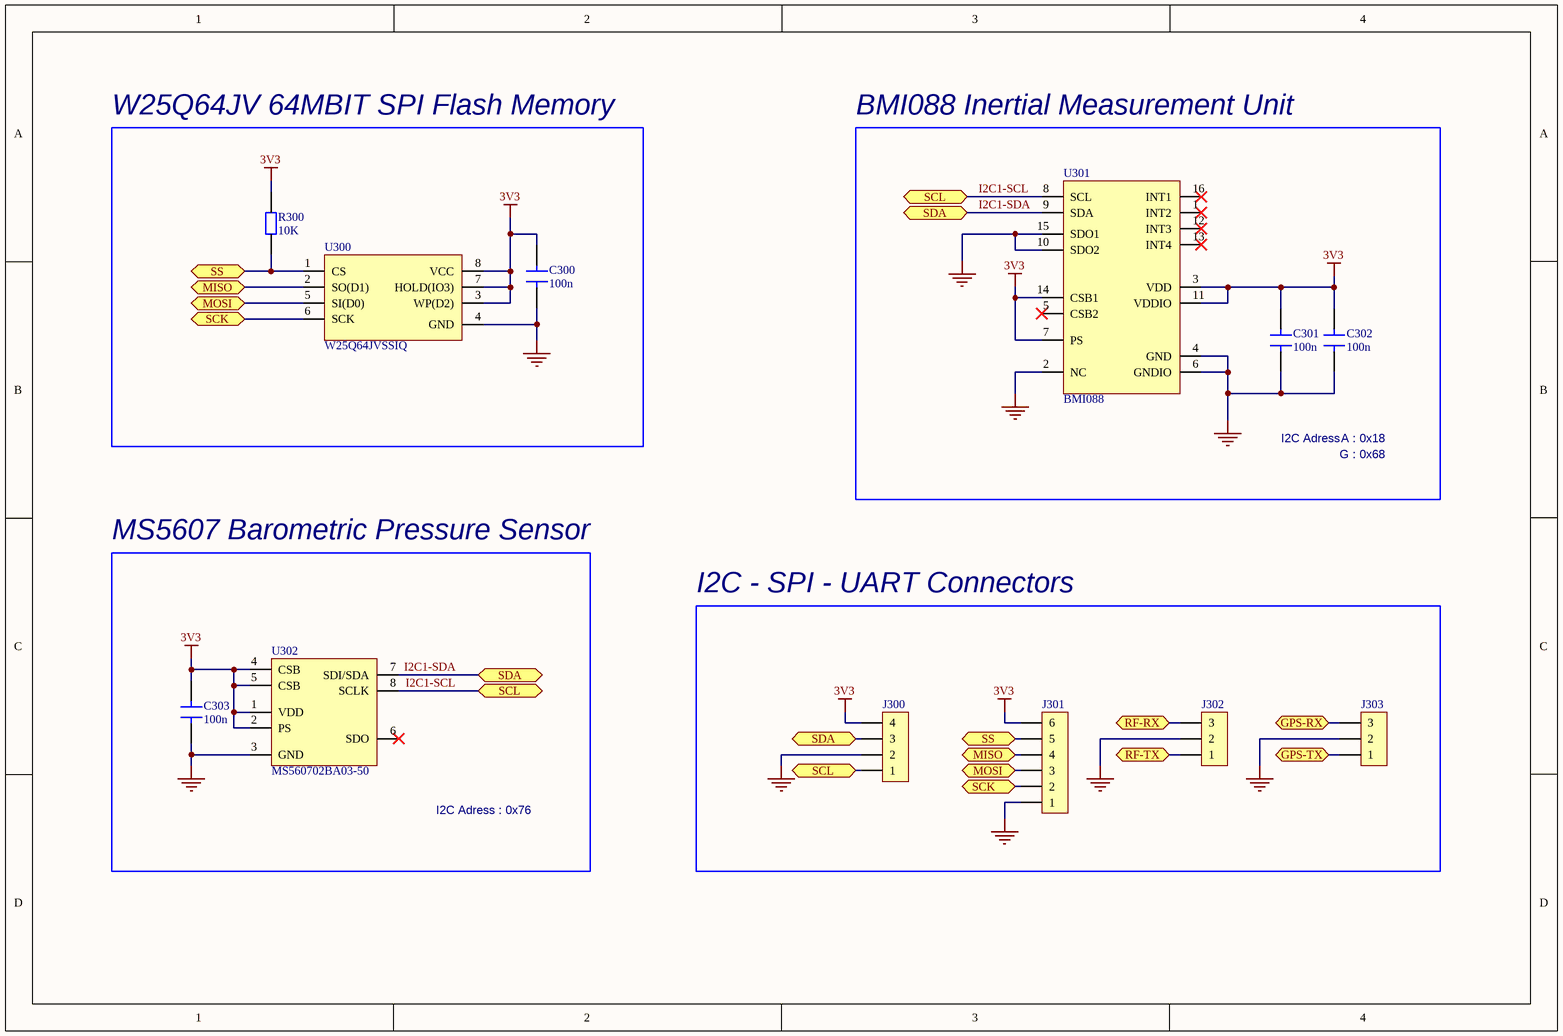
[diagram p3: Peripheral.SchDoc]

### Parts
C300  100n  [CAP 0603]
C301  100n  [CAP 0603]
C302  100n  [CAP 0603]
C303  100n  [CAP 0603]
J300  1x4 HEADER MALE  [1X4 HEADER MALE]  (value not drawn)
J301  1x6 HEADER MALE  [1X6 HEADER MALE]  (value not drawn)
J302  JST B3B-XH-A  [JST_B3B-XH-A]  (value not drawn)
J303  JST B3B-XH-A  [JST_B3B-XH-A]  (value not drawn)
R300  10K  [RES 0603]
U300  W25Q64JVSSIQ  [W25Q64JVSSIQ]
U301  BMI088  [BMI088]
U302  MS560702BA03-50  [MS5607-02BA3]

### Blocks framed on the sheet
W25Q64JV 64MBIT SPI Flash Memory: C300 R300 U300
BMI088 Inertial Measurement Unit: C301 C302 U301
MS5607 Barometric Pressure Sensor: C303 U302
I2C - SPI - UART Connectors: J300-J303

### Ports
GPS-RX (bidir, see MCU[7D]), GPS-TX (bidir, see MCU[7D]), MISO (bidir, see MCU[7C], Peripheral[1B]), MISO (bidir, see MCU[7C], Peripheral[3C]), MOSI (bidir, see MCU[7C], Peripheral[1B]), MOSI (bidir, see MCU[7C], Peripheral[3C]), RF-RX (bidir, see MCU[7D]), RF-TX (bidir, see MCU[7D]), SCK (bidir, see MCU[7C], Peripheral[1B]), SCK (bidir, see MCU[7C], Peripheral[3D]), SCL (bidir, see MCU[7D], Peripheral[2C], Peripheral[3A]), SCL (bidir, see MCU[7D], Peripheral[2C], Peripheral[3C]), SCL (bidir, see MCU[7D], Peripheral[3A], Peripheral[3C]), SDA (bidir, see MCU[7D], Peripheral[2C], Peripheral[3A]), SDA (bidir, see MCU[7D], Peripheral[2C], Peripheral[3C]), SDA (bidir, see MCU[7D], Peripheral[3A], Peripheral[3C]), SS (bidir, see MCU[7D], Peripheral[1B]), SS (bidir, see MCU[7D], Peripheral[3C])

### Nets
3V3: C300.1 C301.2 C302.2 C303.2 J300.4 J301.6 R300.2 U300.3(WP(D2)) U300.7(HOLD(IO3)) U300.8(VCC) U301.3(VDD) U301.7(PS) U301.11(VDDIO) U301.14(CSB1) U302.1(VDD) U302.2(PS) U302.4(CSB) U302.5(CSB)
GND: C300.2 C301.1 C302.1 C303.1 J300.2 J301.1 J302.2 J303.2 U300.4(GND) U301.2(NC) U301.4(GND) U301.6(GNDIO) U301.10(SDO2) U301.15(SDO1) U302.3(GND)
I2C1-SCL: J300.1 U301.8(SCL) U302.8(SCLK) ; port SCL
I2C1-SDA: J300.3 U301.9(SDA) U302.7(SDI/SDA) ; port SDA
MISO: J301.4 U300.2(SO(D1)) ; port MISO
MOSI: J301.3 U300.5(SI(D0)) ; port MOSI
SCK: J301.2 U300.6(SCK) ; port SCK
SS: J301.5 R300.1 U300.1(CS) ; port SS
UART4-RX: J302.1 ; port RF-TX
UART4-TX: J302.3 ; port RF-RX
USART2-RX: J303.1 ; port GPS-TX
USART2-TX: J303.3 ; port GPS-RX

Not connected (* = marked no-connect by the designer): U301 1(INT2)* 5(CSB2)* 12(INT3)* 13(INT4)* 16(INT1)*; U302 6(SDO)*

### Notes on the sheet
- I2C Adress
- A : 0x18
- G : 0x68
- I2C Adress : 0x76

### Library data of the parts
C300-C303 = CAP 0603 50V: Capacitor SMD 0603 50V
J302 J303 = JST B3B-XH-A: Connector Header, XH Series, 3 Position, 2.50mm, Through Hole, Press-Fit, Solder, Natural; Manufacturer Part Number: B3B-XH-A(LF)(SN); Supplier 1: CoreStaff; Manufacturer: JST; RoHS: Yes; Category: Headers and Wire Housings; Stock 1: 2101; Pricing 1: 1=39,94, 10=25,1, 50=21,68, 100=18,25, 500=17,57, 1000=17,12, 2000=16,44, 4000=15,79 (JPY); ComponentLink1URL: https://datasheet.ciiva.com/26894/getdatasheetpartid-640434-26894454.pdf?src-supplier=Verical; ComponentLink1Description: https://datasheet.ciiva.com/26894/getdatasheetpartid-640434-26894454.pdf?src-supplier=Verical; ComponentLink2URL: https://datasheet.ciiva.com/26894/getdatasheetpartid-440399-26894778.pdf?src-supplier=Verical; ComponentLink2Description: https://datasheet.ciiva.com/26894/getdatasheetpartid-440399-26894778.pdf?src-supplier=Verical; ComponentLink3URL: https://datasheet.ciiva.com/11746/0900766b8082653f-11746520.pdf?src-supplier=Rs; ComponentLink3Description: https://datasheet.ciiva.com/11746/0900766b8082653f-11746520.pdf?src-supplier=Rs
R300 = RES 0603: Resistor SMD 0603
U300 = W25Q64JVSSIQ: IC FLASH 64MBIT 104MHZ 8SOIC; Manufacturer: Winbond; Memory Type: Non-Volatile,FLASH; Frequency: 133MHz; Memory Size: 64Mb; Supplier 1: Digi-Key; Manufacturer Part Number: W25Q64JVSSIQ; RoHS: Yes; Category: Flash; Stock 1: 138661; Pricing 1: 1=1,03, 25=0,9212, 100=0,8173, 500=0,7987, 5000=0,72112 (USD); Mount: Surface Mount; Case/Package: SOIC; Number of Pins: 8; Min Operating Temperature: -40°C; Max Operating Temperature: 85°C; Packaging: Rail/Tube; Series: SpiFlash®; RoHS Compliant: Yes; ComponentLink1URL: http://www.winbond.com/resource-files/w25q64jv%20revj%2003272018%20plus.pdf?src-supplier=Digi-Key; ComponentLink1Description: http://www.winbond.com/resource-files/w25q64jv%20revj%2003272018%20plus.pdf?src-supplier=Digi-Key
U301 = BMI088: BMI088 Series 3.6 V 6 Axis Digital Output Accelerometer Motion Sensor - LGA-16; Manufacturer: Bosch Tools; Supplier 1: Arrow Electronics; Manufacturer Part Number: BMI088; RoHS: No; Category: Inertial Measurement Units (IMUs); Stock 1: 2228; Pricing 1: 1=3,4884, 10=3,3155, 25=3,2816, 50=3,2477, 100=3,2147, 500=3,1828 (USD); ComponentLink1URL: https://ae-bst.resource.bosch.com/media/_tech/media/product_flyer/Bosch_Sensortec_Product_flyer_BMI088.pdf?src-supplier=Digi-Key; ComponentLink1Description: https://ae-bst.resource.bosch.com/media/_tech/media/product_flyer/Bosch_Sensortec_Product_flyer_BMI088.pdf?src-supplier=Digi-Key; ComponentLink2URL: https://ae-bst.resource.bosch.com/media/_tech/media/application_notes/BST-MIS-HS001.pdf?src-supplier=Digi-Key; ComponentLink2Description: https://ae-bst.resource.bosch.com/media/_tech/media/application_notes/BST-MIS-HS001.pdf?src-supplier=Digi-Key
U302 = MS560702BA03-50: Board Mount Pressure Sensor 0.01bar to 1.2bar Absolute 8-Pin QFN T/R; Manufacturer: Measurement Specialties; Min Supply Voltage: 1.8V; Max Supply Voltage: 3.6V; Pressure Type: Barometric; Supply Current: 12.5uA; Supplier 1: Utmel Electronic; Manufacturer Part Number: MS560702BA03-50; RoHS: Yes; Category: Pressure Sensors; Stock 1: 4561; Case/Package: QFN; Number of Pins: 8; Min Operating Temperature: -40°C; Max Operating Temperature: 85°C; Reach SVHC Compliant: No; RoHS Compliant: Yes; ComponentLink1URL: https://datasheet.ciiva.com/28418/1756127-28418369.pdf?src-supplier=Element14; ComponentLink1Description: https://datasheet.ciiva.com/28418/1756127-28418369.pdf?src-supplier=Element14; ComponentLink2URL: https://datasheet.ciiva.com/45422/ms5607-02ba03-45422949.pdf?src-supplier=Digi-Key; ComponentLink2Description: https://datasheet.ciiva.com/45422/ms5607-02ba03-45422949.pdf?src-supplier=Digi-Key; ComponentLink3URL: https://datasheet.ciiva.com/45422/ms5607-02ba03-45422950.pdf?src-supplier=Digi-Key; ComponentLink3Description: https://datasheet.ciiva.com/45422/ms5607-02ba03-45422950.pdf?src-supplier=Digi-Key; ComponentLink4URL: https://datasheet.ciiva.com/45422/ms5607-02ba03-45422951.pdf?src-supplier=Digi-Key; ComponentLink4Description: https://datasheet.ciiva.com/45422/ms5607-02ba03-45422951.pdf?src-supplier=Digi-Key

## Nets that join several sheets
3V3: MCU (17 pins), Power (C404.2 C405.2 D401.A U401.5), Peripheral (18 pins)
5V: MCU (C212.1 FB201.1), Power (5 pins)
GND: MCU (29 pins), Power (17 pins), Peripheral (15 pins)
I2C1-SCL: MCU (R206.1 U200.58), Peripheral (J300.1 U301.8 U302.8)
I2C1-SDA: MCU (R207.1 U200.59), Peripheral (J300.3 U301.9 U302.7)
MISO: MCU (U200.22), Peripheral (J301.4 U300.2)
MOSI: MCU (U200.23), Peripheral (J301.3 U300.5)
NetR202_1: MCU (R202.1), Power (R401.1)
NetR203_2: MCU (R203.2), Power (R403.1)
SCK: MCU (U200.21), Peripheral (J301.2 U300.6)
SS: MCU (U200.20), Peripheral (J301.5 R300.1 U300.1)
UART4-RX: MCU (U200.15), Peripheral (J302.1)
UART4-TX: MCU (U200.14), Peripheral (J302.3)
USART2-RX: MCU (U200.17), Peripheral (J303.1)
USART2-TX: MCU (U200.16), Peripheral (J303.3)